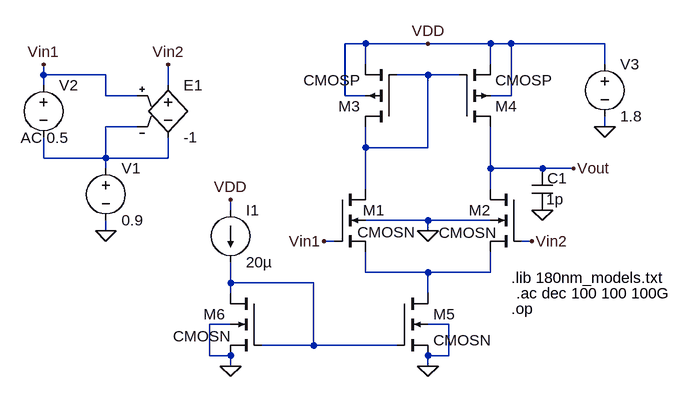
[diagram p0: schematic DIFAMP.asc]
DIFAMP.asc, the LTspice schematic file:
Version 4
SHEET 1 880 680
WIRE 112 -48 80 -48
WIRE 208 -48 112 -48
WIRE 304 -48 208 -48
WIRE 336 -48 304 -48
WIRE 480 -48 336 -48
WIRE 112 -16 112 -48
WIRE 304 -16 304 -48
WIRE 480 -16 480 -48
WIRE -384 0 -384 -16
WIRE -288 0 -384 0
WIRE 208 0 160 0
WIRE 256 0 208 0
WIRE -384 16 -384 0
WIRE -192 16 -192 -16
WIRE -288 32 -288 0
WIRE -240 32 -288 32
WIRE 80 32 80 -48
WIRE 112 32 80 32
WIRE 336 32 336 -48
WIRE 336 32 304 32
WIRE -240 80 -288 80
WIRE 480 80 480 64
WIRE 112 112 112 80
WIRE 208 112 208 0
WIRE 208 112 112 112
WIRE -384 128 -384 96
WIRE -288 128 -288 80
WIRE -288 128 -384 128
WIRE -192 128 -192 96
WIRE -192 128 -288 128
WIRE -288 144 -288 128
WIRE 304 144 304 80
WIRE 384 144 304 144
WIRE 432 144 384 144
WIRE 112 176 112 112
WIRE 304 176 304 144
WIRE -96 208 -96 192
WIRE 208 224 112 224
WIRE 304 224 208 224
WIRE -288 240 -288 224
WIRE 208 240 208 224
WIRE 64 256 48 256
WIRE 368 256 352 256
WIRE 112 304 112 272
WIRE 208 304 112 304
WIRE 304 304 304 272
WIRE 304 304 208 304
WIRE -96 320 -96 288
WIRE 32 320 -96 320
WIRE -96 336 -96 320
WIRE 208 336 208 304
WIRE -96 384 -128 384
WIRE 240 384 208 384
WIRE 32 416 32 320
WIRE 32 416 -48 416
WIRE 160 416 32 416
WIRE -128 432 -128 384
WIRE -96 432 -128 432
WIRE 240 432 240 384
WIRE 240 432 208 432
WIRE -96 448 -96 432
WIRE 208 448 208 432
FLAG -96 448 0
FLAG 208 448 0
FLAG 480 80 0
FLAG 208 -48 VDD
FLAG -384 -16 Vin1
FLAG 48 256 Vin1
FLAG -192 -16 Vin2
FLAG 368 256 Vin2
FLAG 208 240 0
FLAG 432 144 Vout
FLAG -288 240 0
FLAG -96 192 VDD
FLAG 384 208 0
SYMBOL nmos4 64 176 R0
WINDOW 0 44 32 Left 2
WINDOW 3 35 66 Left 2
SYMATTR InstName M1
SYMATTR Value CMOSN
SYMATTR Value2 l=3.5u w=3.5u m=6
SYMBOL nmos4 352 176 M0
WINDOW 0 47 32 Left 2
WINDOW 3 38 67 Left 2
SYMATTR InstName M2
SYMATTR Value CMOSN
SYMATTR Value2 l=3.5u w=3.5u m=6
SYMBOL pmos4 160 80 R180
SYMATTR InstName M3
SYMATTR Value CMOSP
SYMATTR Value2 l=3.5u w=42u m=16
SYMBOL pmos4 256 80 M180
SYMATTR InstName M4
SYMATTR Value CMOSP
SYMATTR Value2 l=3.5u w=42u m=16
SYMBOL nmos4 160 336 R0
SYMATTR InstName M5
SYMATTR Value CMOSN
SYMATTR Value2 l=0.5u w=1u m=38
SYMBOL nmos4 -48 336 M0
WINDOW 3 47 66 Left 2
SYMATTR Value CMOSN
SYMATTR InstName M6
SYMATTR Value2 l=0.5u w=1u m=4
SYMBOL current -96 208 R0
WINDOW 123 0 0 Left 0
WINDOW 39 0 0 Left 0
SYMATTR InstName I1
SYMATTR Value 20µ
SYMBOL voltage -288 128 R0
WINDOW 123 0 0 Left 0
WINDOW 39 0 0 Left 0
SYMATTR InstName V1
SYMATTR Value 0.9
SYMBOL voltage -384 0 R0
WINDOW 123 -35 97 Left 2
WINDOW 39 0 0 Left 0
SYMATTR Value2 AC 0.5
SYMATTR InstName V2
SYMATTR Value ""
SYMBOL e -192 0 R0
SYMATTR InstName E1
SYMATTR Value -1
SYMBOL voltage 480 -32 R0
WINDOW 123 0 0 Left 0
WINDOW 39 0 0 Left 0
SYMATTR InstName V3
SYMATTR Value 1.8
SYMBOL cap 368 144 R0
WINDOW 0 24 15 Left 2
WINDOW 3 22 47 Left 2
SYMATTR InstName C1
SYMATTR Value 1p
TEXT 336 312 Left 2 !.lib 180nm_models.txt
TEXT 344 336 Left 2 !.ac dec 100 100 100G
TEXT 336 360 Left 2 !.op

The netlist it stands for:
* DIFAMP.asc
M1 N001 Vin1 N003 0 CMOSN l=3.5u w=3.5u m=6
M2 Vout Vin2 N003 0 CMOSN l=3.5u w=3.5u m=6
M3 N001 N001 VDD VDD CMOSP l=3.5u w=42u m=16
M4 Vout N001 VDD VDD CMOSP l=3.5u w=42u m=16
M5 N003 N004 0 0 CMOSN l=0.5u w=1u m=38
M6 N004 N004 0 0 CMOSN l=0.5u w=1u m=4
I1 VDD N004 20µ
V1 N002 0 0.9
V2 Vin1 N002 AC 0.5
E1 Vin2 N002 Vin1 N002 -1
V3 VDD 0 1.8
C1 Vout 0 1p
.model NMOS NMOS
.model PMOS PMOS
.lib standard.mos
.lib 180nm_models.txt
.ac dec 100 100 100G
.op
.backanno
.end